# EAGLE design Schema IOT v0.3 (EAGLE 9.6.2)
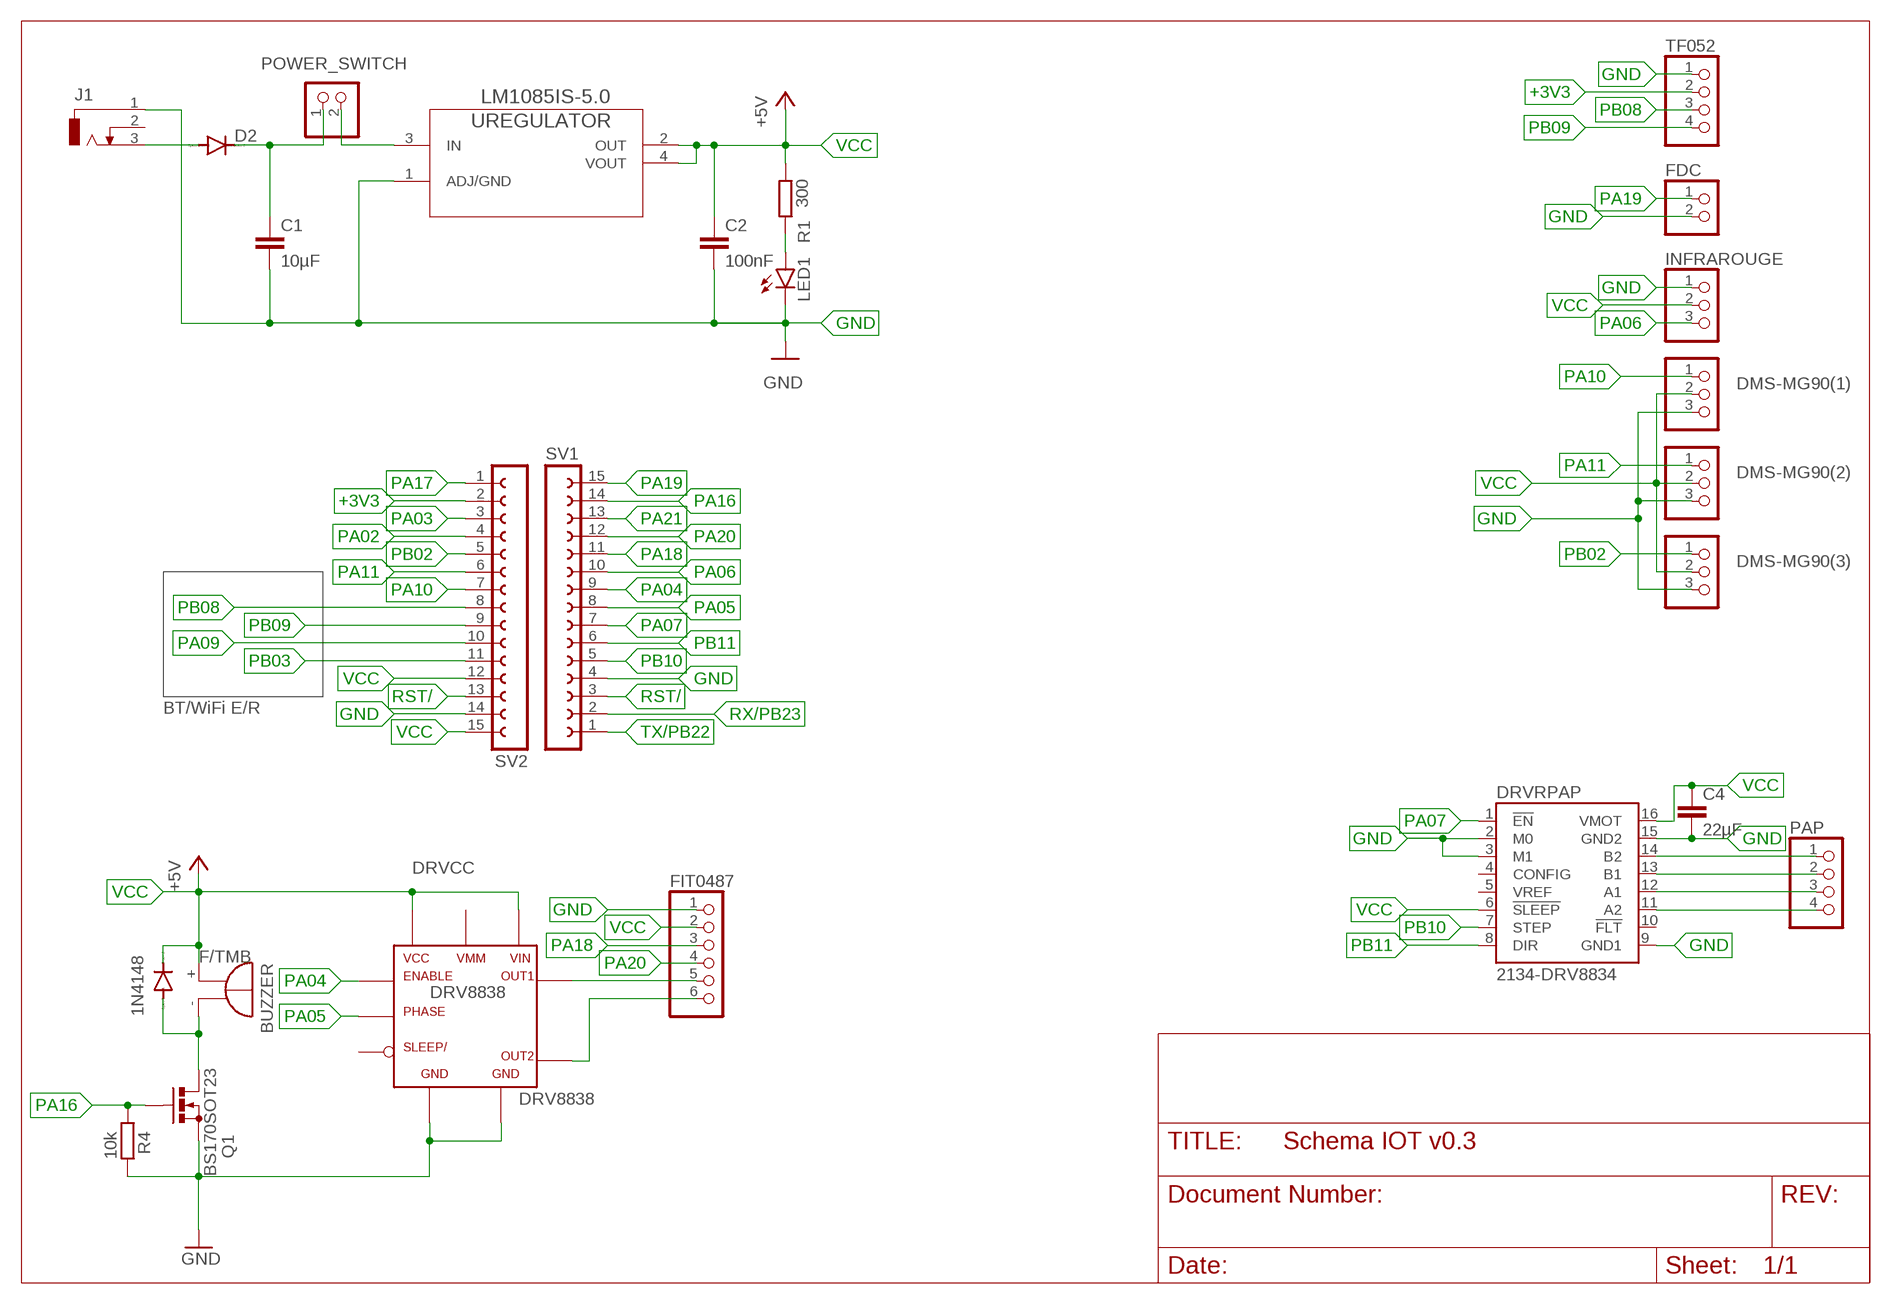
[diagram p0: schematic, sheet 1]

## Parts
BUZZER  F/TMB  [F/TMB]
C1  10µF  C-EUC1206  [C1206]
C2  100nF  C-EUC1206  [C1206]
C4  22µF  C-EU025-050X050  [C025-050X050]
D1  1N4148  [SOD-123_MINI-SMA]
D2  DIODE-DO214AC  [DO214AC]
DMS-MG90(1)  PINHD-1X3  [1X03]
DMS-MG90(2)  PINHD-1X3  [1X03]
DMS-MG90(3)  PINHD-1X3  [1X03]
DRVCC  DRV8838  [DRV8838]
DRVRPAP  2134-DRV8834  [DRV8834]
FDC  PINHD-1X2  [1X02]
FIT0487  PINHD-1X6  [1X06]
INFRAROUGE  PINHD-1X3  [1X03]
J1  DCJ0303  [DCJ0303]
LED1  LED5MM  [LED5MM]
PAP  PINHD-1X4  [1X04]
POWER_SWITCH  PINHD-1X2  [1X02]
Q1  BS170SOT23  [SOT23]
R1  300  R-EU_R1206  [R1206]
R4  10k  R-EU_R1206  [R1206]
SV1  FE15-1  [FE15]
SV2  FE15-1  [FE15]
TF052  PINHD-1X4  [1X04]
UREGULATOR  LM1085IS-5.0  [TO254P1435X457-3N]

## Nets
+3V3: SV2.2 TF052.2
GND: C1.2 C2.2 C4.2 DMS-MG90(1).3 DMS-MG90(2).3 DMS-MG90(3).3 DRVCC.GND1 DRVCC.GND2 DRVRPAP.2(M0) DRVRPAP.3(M1) DRVRPAP.9(GND1) DRVRPAP.15(GND2) FDC.2 FIT0487.1 INFRAROUGE.1 J1.1 LED1.K(C) Q1.2(S) R4.2 SV1.4 SV2.14 TF052.1 UREGULATOR.1(ADJ/GND)
M1: DRVCC.OUT1 FIT0487.5
M2: DRVCC.OUT2 FIT0487.6
N$1: POWER_SWITCH.2 UREGULATOR.3(IN)
N$2: D2.A J1.3
N$3: DRVRPAP.11(A2) PAP.4
N$4: DRVRPAP.12(A1) PAP.3
N$5: DRVRPAP.13(B1) PAP.2
N$6: DRVRPAP.14(B2) PAP.1
N$10: BUZZER.- D1.A Q1.3(D)
N$19: LED1.A R1.1
N$28: C1.1 D2.C POWER_SWITCH.1
PA02: SV2.4
PA03: SV2.3
PA04: DRVCC.ENABLE SV1.9
PA05: DRVCC.PHASE SV1.8
PA06: INFRAROUGE.3 SV1.10
PA07: DRVRPAP.1(!EN) SV1.7
PA09: SV2.10
PA10: DMS-MG90(1).1 SV2.7
PA11: DMS-MG90(2).1 SV2.6
PA16: Q1.1(G) R4.1 SV1.14
PA17: SV2.1
PA18: FIT0487.3 SV1.11
PA19: FDC.1 SV1.15
PA20: FIT0487.4 SV1.12
PA21: SV1.13
PB02: DMS-MG90(3).1 SV2.5
PB03: SV2.11
PB08: SV2.8 TF052.3
PB09: SV2.9 TF052.4
PB10: DRVRPAP.7(STEP) SV1.5
PB11: DRVRPAP.8(DIR) SV1.6
RST/: SV1.3 SV2.13
RX/PB23: SV1.2
TX/PB22: SV1.1
VCC: BUZZER.+ C2.1 C4.1 D1.C DMS-MG90(1).2 DMS-MG90(2).2 DMS-MG90(3).2 DRVCC.VCC DRVCC.VIN DRVRPAP.6(!SLEEP) DRVRPAP.16(VMOT) FIT0487.2 INFRAROUGE.2 R1.2 SV2.12 SV2.15 UREGULATOR.2(OUT) UREGULATOR.4(VOUT) ; supply symbol labelled +5V
Unconnected: DRVCC.SLEEP/ DRVCC.VMM DRVRPAP.4(CONFIG) DRVRPAP.5(VREF) DRVRPAP.10(!FLT) J1.2

## Notes on the sheet
- BT/WiFi E/R

## Library data of the parts
BUZZER = buzzer:F/TMB: BUZZER Source: Buerklin; OC_FARNELL: unknown; OC_NEWARK: unknown
C1 C2 = LivetProjet:C-EU: CAPACITOR, European symbol
C4 = rcl:C-EU: CAPACITOR, European symbol; SPICEPREFIX: C
D1 = LivetProjet:1N4148: DIODE high speed (Philips)
D2 = diode:DIODE-: DIODE
DMS-MG90(1) DMS-MG90(2) DMS-MG90(3) INFRAROUGE = pinhead:PINHD-1X3: PIN HEADER
DRVCC = LivetProjet:DRV8838: This tiny breakout board for TI’s DRV8838 motor driver can deliver a continuous 1.7 A (1.8 A peak) to a single brushed DC motor. With an operating voltage range from 0 V to 11 V and built-in protection against reverse-voltage, under-voltage, over-current, and over-temperature, this driver is a great solution for powering a small, low-voltage motor. The carrier board has the form factor of a 10-pin DIP package, which makes it easy to use with standard solderless breadboards and 0.1″ perfboards.; ACHAT: https://www.gotronic.fr/art-commande-moteur-cc-1-x-1-7a-2990-29145.htm; DOC: https://www.pololu.com/product/2990
DRVRPAP = pololu-stepper-driver:2134-DRV8834: DRV8834 Low-Voltage Stepper Motor Driver Carrier #2134 DRV8834 Low-Voltage Stepper Motor Driver Carrier <https://www.pololu.com/product/2134> in Japan, Suzaku Lab. Ltd. <https://suzakugiken.jp/> #2134 DRV8834 低電圧用ステッピングモータドライバ <https://szc.jp/po2134>
FDC POWER_SWITCH = pinhead:PINHD-1X2: PIN HEADER
FIT0487 = pinhead:PINHD-1X6: PIN HEADER
J1 = con-jack:DCJ0303: DC POWER JACK Source: DCJ0303.pdf; OC_FARNELL: unknown; OC_NEWARK: unknown
LED1 = led:LED: LED OSRAM: - CHIPLED LG R971, LG N971, LY N971, LG Q971, LY Q971, LO R971, LY R971 LH N974, LH R974 LS Q976, LO Q976, LY Q976 LO Q996 - Hyper CHIPLED LW Q18S LB Q993, LB Q99A, LB R99A - SideLED LS A670, LO A670, LY A670, LG A670, LP A670 LB A673, LV A673, LT A673, LW A673 LH A674 LY A675 LS A676, LA A676, LO A676, LY A676, LW A676 LS A679, LY A679, LG A679 - Hyper Micro SIDELED® LS Y876, LA Y876, LO Y876, LY Y876 LT Y87S - SmartLED LW L88C, LW L88S LB L89C, LB L89S, LG L890 LS L89K, LO L89K, LY L89K LS L896, LA L896, LO L896, LY L896 - TOPLED LS T670, LO T670, LY T670, LG T670, LP T670 LSG T670, LSP T670, LSY T670, LOP T670, LYG T670 LG T671, LOG T671, LSG T671 LB T673, LV T673, LT T673, LW T673 LH T674 LS T676, LA T676, LO T676, LY T676, LB T676, LH T676, LSB T676, LW T676 LB T67C, LV T67C, LT T67C, LS T67K, LO T67K, LY T67K, LW E67C LS E67B, LA E67B, LO E67B, LY E67B, LB E67C, LV E67C, LT E67C LW T67C LS T679, LY T679, LG T679 LS T770, LO T770, LY T770, LG T770, LP T770 LB T773, LV T773, LT T773, LW T773 LH T774 LS E675, LA E675, LY E675, LS T675 LS T776, LA T776, LO T776, LY T776, LB T776 LHGB T686 LT T68C, LB T68C - Hyper Mini TOPLED® LB M676 - Mini TOPLED Santana® LG M470 LS M47K, LO M47K, LY M47K Source: http://www.osram.convergy.de LUXEON: - LUMILED® LXK2-PW12-R00, LXK2-PW12-S00, LXK2-PW14-U00, LXK2-PW14-V00 LXK2-PM12-R00, LXK2-PM12-S00, LXK2-PM14-U00 LXK2-PE12-Q00, LXK2-PE12-R00, LXK2-PE12-S00, LXK2-PE14-T00, LXK2-PE14-U00 LXK2-PB12-K00, LXK2-PB12-L00, LXK2-PB12-M00, LXK2-PB14-N00, LXK2-PB14-P00, LXK2-PB14-Q00 LXK2-PR12-L00, LXK2-PR12-M00, LXK2-PR14-Q00, LXK2-PR14-R00 LXK2-PD12-Q00, LXK2-PD12-R00, LXK2-PD12-S00 LXK2-PH12-R00, LXK2-PH12-S00 LXK2-PL12-P00, LXK2-PL12-Q00, LXK2-PL12-R00 Source: www.luxeon.com KINGBRIGHT: KA-3528ASYC Source: www.kingbright.com
PAP TF052 = pinhead:PINHD-1X4: PIN HEADER
Q1 = transistor-small-signal:BS170: N-CHANNEL MOS FET
R1 R4 = rcl:R-EU_: RESISTOR, European symbol; SPICEPREFIX: R
SV1 SV2 = con-lsta:FE15-1: FEMALE HEADER; OC_FARNELL: unknown; OC_NEWARK: unknown
UREGULATOR = LM1085IS-5.0:LM1085IS-5.0: Low Dropout Positive Regulators Check availability <https://pricing.snapeda.com/parts/LM1085IS-5.0/Texas%20Instruments/view-part?ref=eda>; AVAILABILITY: In Stock; DESCRIPTION: Linear Voltage Regulator IC Positive Fixed 1 Output 3A DDPAK/TO-263-3; MF: Texas Instruments; MP: LM1085IS-5.0; PACKAGE: TO-263 Texas Instruments; PRICE: None; PURCHASE-URL: https://pricing.snapeda.com/search/part/LM1085IS-5.0/?ref=eda

## Board
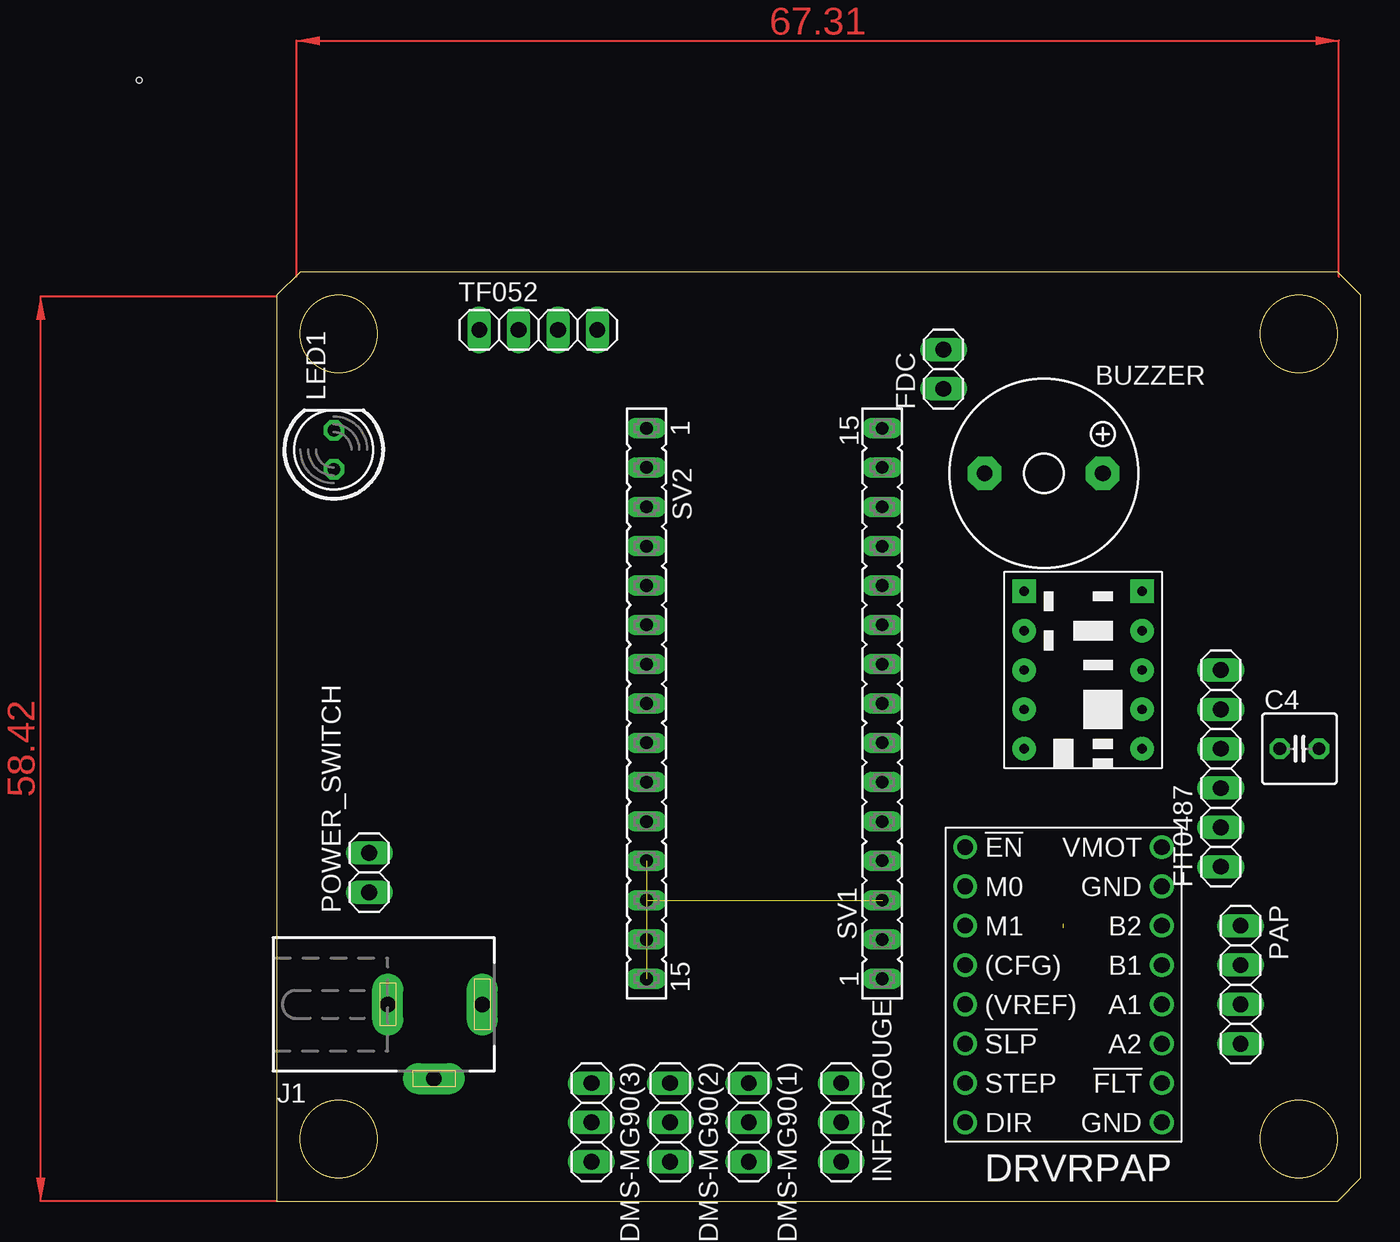
[diagram p1: board, top side]
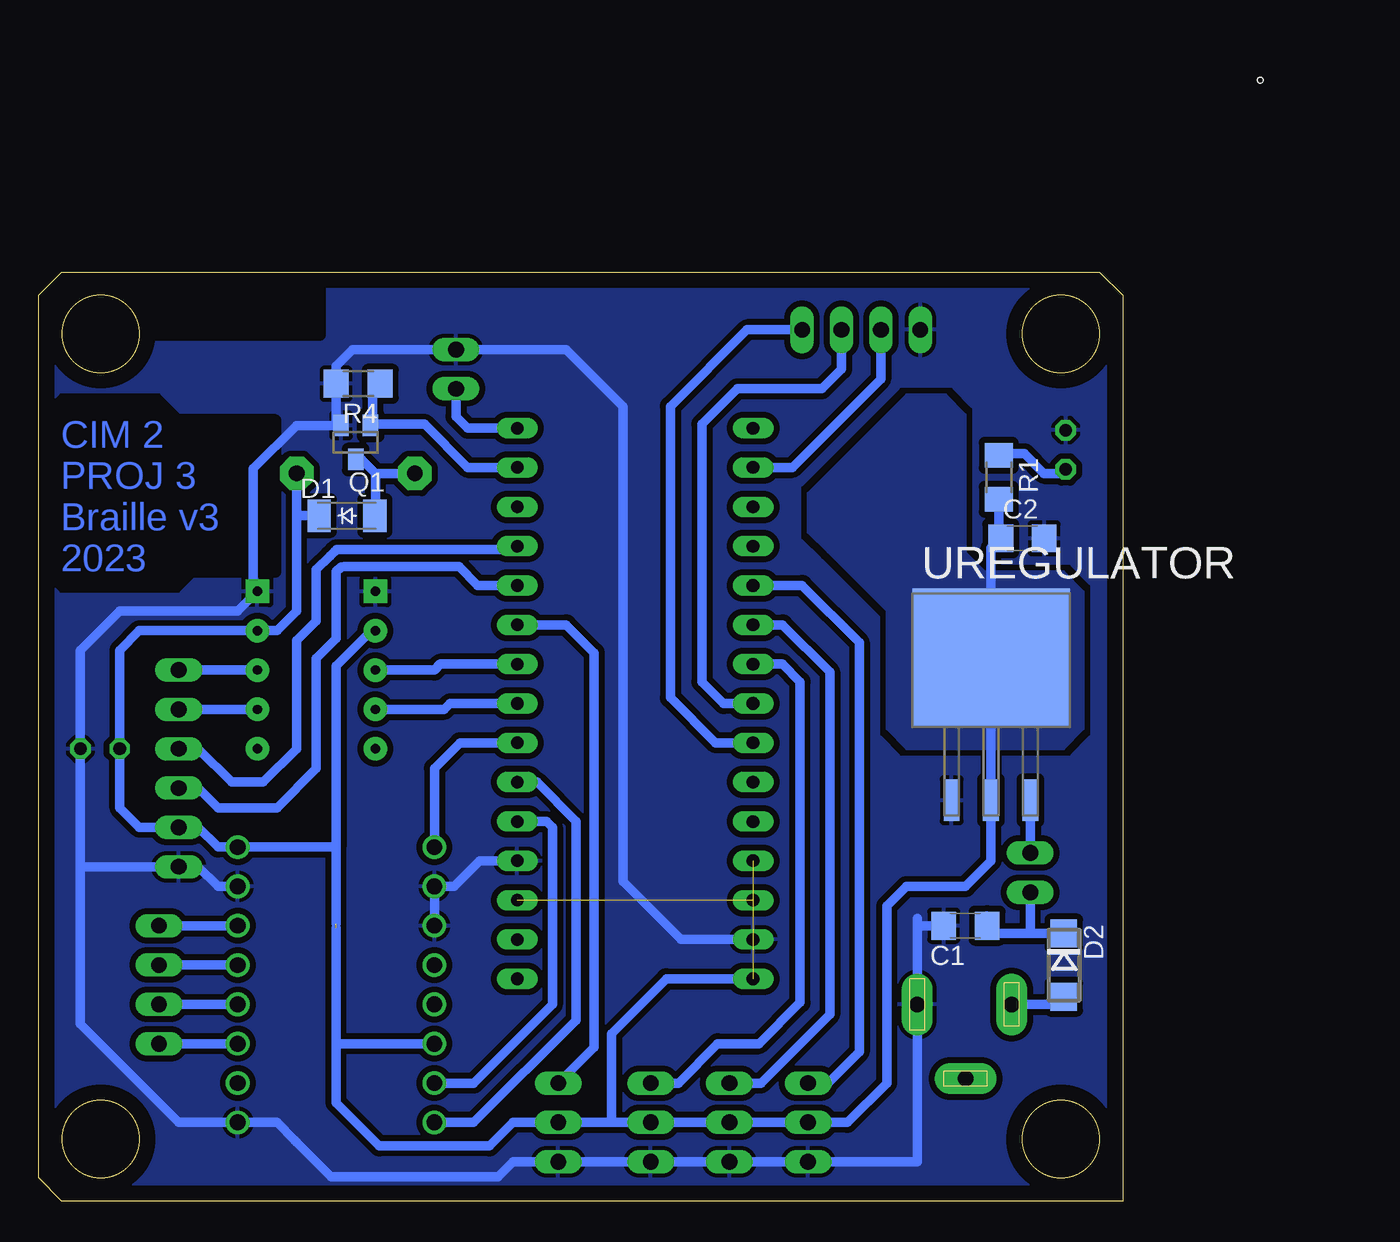
[diagram p2: board, bottom side, seen from below]

Size 70 x 60 mm. Coordinates in mm from the lower left corner, seen from the top.
Outline: 70,58.5 68.5,60 1.5,60 0,58.5 0,0 68.5,0 70,1.5 70,58.5
Outline: circle at 4,56 radius 2.5
Outline: circle at 66,56 radius 2.5
Outline: circle at 66,4 radius 2.5
Outline: circle at 4,4 radius 2.5
Copper layers (1*16): Top 0.035mm / dielectric 1.5mm / Bottom 0.035mm
Design rules "default *": minimum track width 6mil, minimum drill 0.35mm, track to track 15mil, track to pad 15mil, pad to pad 15mil, via to via 15mil, smd to smd 15mil, copper to edge 40mil, drill to drill 6mil, minimum pad ring 10mil, minimum via ring 8mil, stop-mask expansion 4mil, vias tented up to drill 0mil, thermal gap 10mil
Holes 0.35 mm at -8.89,72.39

### Footprints (pad centres in the part's own frame; a part is rotated, then mirrored left to right if it is on the bottom)
F/TMB = drill 1.016 pad 2.159 octagon: + 3.81,0; - -3.81,0
C1206 = smd 1.6 x 1.8: 1 -1.4,0; 2 1.4,0
C025-050X050 = drill 0.813 octagon: 1 -1.27,0; 2 1.27,0
SOD-123_MINI-SMA = smd 1.5 x 2.1: A 1.8,0; C -1.8,0
DO214AC = smd 1.8 x 1.7: A 2.05,0; C -2.05,0
1X03 = drill 1.016 long: 1 -2.54,0; 2 0,0; 3 2.54,0
DRV8838 = drill 0.6 pad 1.524: ENABLE -3.81,-1.27; OUT1 3.81,-3.81; OUT2 3.81,-1.27; PHASE -3.81,-3.81; SLEEP/ -3.81,-6.35; VCC -3.81,1.27; VIN 3.81,1.27; VMM 3.81,-6.35 | drill 0.6 pad 1.524 square: GND1 -3.81,3.81; GND2 3.81,3.81
DRV8834 = drill 1.016: 1 -6.35,8.89; 2 -6.35,6.35; 3 -6.35,3.81; 4 -6.35,1.27; 5 -6.35,-1.27; 6 -6.35,-3.81; 7 -6.35,-6.35; 8 -6.35,-8.89; 9 6.35,-8.89; 10 6.35,-6.35; 11 6.35,-3.81; 12 6.35,-1.27; 13 6.35,1.27; 14 6.35,3.81; 15 6.35,6.35; 16 6.35,8.89
1X02 = drill 1.016 long: 1 -1.27,0; 2 1.27,0
1X06 = drill 1.016 long: 1 -6.35,0; 2 -3.81,0; 3 -1.27,0; 4 1.27,0; 5 3.81,0; 6 6.35,0
DCJ0303 = drill 1 pad 2 long: 1 0,3.1; 2 4.8,0; 3 0,-3
LED5MM = drill 0.813 octagon: A -1.27,0; K 1.27,0
1X04 = drill 1.016 long: 1 -3.81,0; 2 -1.27,0; 3 1.27,0; 4 3.81,0
SOT23 = smd 1 x 1.4: 1 -0.95,-1.1; 2 0.95,-1.1; 3 0,1.1
R1206 = smd 1.6 x 1.803: 1 -1.422,0; 2 1.422,0
FE15 = drill 0.813 long: 1 -17.78,0; 2 -15.24,0; 3 -12.7,0; 4 -10.16,0; 5 -7.62,0; 6 -5.08,0; 7 -2.54,0; 8 0,0; 9 2.54,0; 10 5.08,0; 11 7.62,0; 12 10.16,0; 13 12.7,0; 14 15.24,0; 15 17.78,0
TO254P1435X457-3N = smd 1.016 x 2.692: 1 -2.54,-9.042; 2 0,-9.042; 3 2.54,-9.042 | smd 10.16 x 8.941: 4 0,0.152

### Placement (x,y rotation side)
BUZZER  49.53,46.99 0 top
C1  10.16,17.78 180 bottom
C2  6.48,42.8 0 bottom
C4  66.04,29.21 0 top
D1  50.09,44.26 0 bottom
D2  3.81,15.24 270 bottom
DMS-MG90(1)  30.48,5.08 270 top
DMS-MG90(2)  25.4,5.08 270 top
DMS-MG90(3)  20.32,5.08 270 top
DRVCC  52.07,35.56 0 top
DRVRPAP  50.8,13.97 0 top
FDC  43.05,53.72 90 top
FIT0487  60.96,27.94 90 top
INFRAROUGE  36.45,5.08 90 top
J1  10.16,12.7 270 top
LED1  3.68,48.51 90 top
PAP  62.23,13.97 270 top
POWER_SWITCH  5.97,21.21 90 top
Q1  49.53,48.99 180 bottom
R1  8,46.74 270 bottom
R4  49.37,52.78 180 bottom
SV1  39.11,32.13 90 top
SV2  23.88,32.13 270 top
TF052  16.89,56.26 0 top
UREGULATOR  8.51,34.92 0 bottom

### Tracks (layer width: path | path; a pad name or v marks a point on that pad's centre or on a via)
+3V3
  Bottom 0.61: SV2.2 21.34,47.37 15.62,53.09 TF052.2
GND
  Bottom 0.61: J1.1 13.26,2.54 DMS-MG90(3).3 DMS-MG90(2).3 DMS-MG90(1).3 INFRAROUGE.1 39.37,2.54 40.34,1.57 51.1,1.57 53.34,3.81 | DRVRPAP.15 58.42,20.32 59.69,21.59 FIT0487.1 67.31,21.59 | DRVCC.GND2 56,39.37 | DRVCC.GND2 56.14,39.37 56.14,47.29 53.34,50.09 Q1.2 50.79,50.4 R4.2 50.79,53.93 49.73,54.99 FDC.2 35.94,54.99 32.26,51.31 32.26,20.64 28.51,16.89 SV2.14 | 64.77,38.1 57.15,38.1 DRVCC.GND2 | J1.1 13.46,12.9 | 13.26,18.26 13.26,17.78 | 13.26,17.78 J1.1 | 53.47,3.94 54.61,5.08 DRVRPAP.9 60.96,5.08 67.31,11.43 67.31,21.59 | DRVRPAP.3 DRVRPAP.2 43.18,20.32 41.53,21.97 SV1.4 | 67.31,21.59 C4.2 67.31,35.55 64.77,38.09 | C1.2 13.26,17.78
  pour Bottom (rank 2): 1.27,59.69 68.58,59.69 69.85,58.42 69.85,1.27 68.58,0 0,0 0,58.42
  pour Bottom: 69.85,39.37 60.96,39.37 57.15,43.18 57.15,46.99 62.23,52.07 69.85,52.07
  cutout Bottom: 68.58,39.37 60.96,39.37 57.15,43.18 57.15,46.99 62.23,52.07 68.58,52.07 69.85,50.8 69.85,40.64
M1
  Bottom 0.61: FIT0487.5 DRVCC.OUT1
M2
  Bottom 0.61: FIT0487.6 DRVCC.OUT2
N$1
  Bottom 0.61: UREGULATOR.3 POWER_SWITCH.2
N$2
  Bottom 0.61: J1.3 5.08,12.7 4.3,12.7 | 4.3,12.7 3.81,12.7 | D2.A 4.3,12.7
N$3
  Bottom 0.61: DRVRPAP.11 PAP.4
N$4
  Bottom 0.61: PAP.3 DRVRPAP.12
N$5
  Bottom 0.61: DRVRPAP.13 PAP.2
N$6
  Bottom 0.61: PAP.1 DRVRPAP.14
N$10
  Bottom 0.61: D1.A 48.26,44.28 48.26,46.99 | 48.26,46.99 49.16,47.89 Q1.3 | 48.26,46.99 BUZZER.-
N$19
  Bottom 0.61: R1.1 7.9,48.26 6.35,48.26 5.08,46.99 3.94,46.99 LED1.A
N$28
  Bottom 0.61: 8.76,18.42 C1.1 8.27,17.29 5.97,17.29 | 5.97,17.29 D2.C | 5.97,17.29 POWER_SWITCH.1
PA04
  Bottom 0.61: SV1.9 44.07,34.67 44.45,34.29 DRVCC.ENABLE
PA05
  Bottom 0.61: SV1.8 43.43,32.13 43.81,31.75 DRVCC.PHASE
PA06
  Bottom 0.61: SV1.10 35.94,37.21 34.14,35.41 34.14,9.93 INFRAROUGE.3
PA07
  Bottom 0.61: SV1.7 42.8,29.59 44.45,27.94 DRVRPAP.1
PA10
  Bottom 0.61: DMS-MG90(1).1 28.7,7.62 26.16,10.16 23.5,10.16 20.83,12.83 20.83,33.53 21.97,34.67 SV2.7
PA11
  Bottom 0.61: SV2.6 21.97,37.21 18.92,34.16 18.92,12.06 23.37,7.62 DMS-MG90(2).1
PA16
  Bottom 0.61: R4.1 48.45,52.28 48.45,50.22 Q1.1 48.51,50.16 45.09,50.16 42.29,47.37 SV1.14
PA18
  Bottom 0.61: SV1.11 41.65,39.75 42.86,40.96 50.29,40.96 50.48,40.96 50.8,40.64 50.8,36.32 52.07,35.05 52.07,27.94 54.61,25.4 58.42,25.4 59.69,26.67 FIT0487.3
PA19
  Bottom 0.61: FDC.1 43.05,50.67 42.29,49.91 SV1.15
PA20
  Bottom 0.61: FIT0487.4 59.69,29.21 57.53,27.05 55.5,27.05 53.34,29.21 53.34,36.2 52.07,37.47 52.07,40.77 51.19,41.66 50.91,41.94 50.9,41.95 50.77,42.07 39.33,42.07 SV1.12
PB02
  Bottom 0.61: SV2.5 20.7,39.75 17.02,36.07 17.02,9.65 19.05,7.62 DMS-MG90(3).1
PB08
  Bottom 0.61: TF052.3 18.16,53.72 19.43,52.45 24.89,52.45 27.18,50.16 27.18,33.53 25.78,32.13 SV2.8
PB09
  Bottom 0.61: TF052.4 24.26,56.26 29.21,51.31 29.21,32.51 26.29,29.59 SV2.9
PB10
  Bottom 0.61: SV1.5 37.21,24.51 36.83,24.13 36.83,12.7 41.91,7.62 DRVRPAP.7
PB11
  Bottom 0.61: SV1.6 37.84,27.05 35.31,24.52 35.31,11.68 41.91,5.08 DRVRPAP.8
RST/  (1 unrouted)
VCC  (2 unrouted)
  Bottom 0.61: INFRAROUGE.2 DMS-MG90(1).2 DMS-MG90(2).2 DMS-MG90(3).2 17.78,5.08 15.24,7.62 15.24,19.05 13.97,20.32 10.16,20.32 8.51,21.97 UREGULATOR.2 UREGULATOR.4 8.51,42.17 C2.1 8,42.93 R1.2 | INFRAROUGE.2 33.02,5.08 33.02,10.79 29.46,14.35 SV2.15 | DRVCC.VCC 48.51,36.83 50.8,34.54 50.8,22.86 | 50.8,22.86 DRVRPAP.16 58.42,22.86 59.69,24.13 FIT0487.2 63.5,24.13 64.77,25.4 C4.1 64.77,35.56 63.5,36.83 DRVCC.VIN 54.61,36.83 53.34,38.1 53.34,44.45 | DRVRPAP.6 50.8,10.16 | INFRAROUGE.2 39.37,5.08 40.89,3.56 48.01,3.56 50.8,6.35 50.8,10.16 | 53.34,44.45 BUZZER.+ | 53.34,44.45 53.15,44.26 D1.C | 50.8,10.16 50.8,17.65 | 50.8,17.91 50.8,22.86
  pour Bottom (isolate 0.305, no thermals): 2.54,30.48 3.81,29.21 13.97,29.21 15.24,30.48 15.24,38.1 19.05,41.91 20.32,43.18 20.32,45.72 13.97,52.07 11.43,52.07 10.16,50.8 10.16,41.91 8.89,40.64 3.81,40.64 2.54,39.37
(copper drawn outside any net)
  shapes: Top area x2

### Text on the board
Bottom: ⠨⠊⠍⠏⠗⠊⠍⠁⠝⠞⠑ / ⠨⠃⠗⠁⠊⠇⠇⠑ | CIM 2 / PROJ 3 / Braille v3 / 2023